# EAGLE design cc2651r3 (EAGLE 9.6.2)
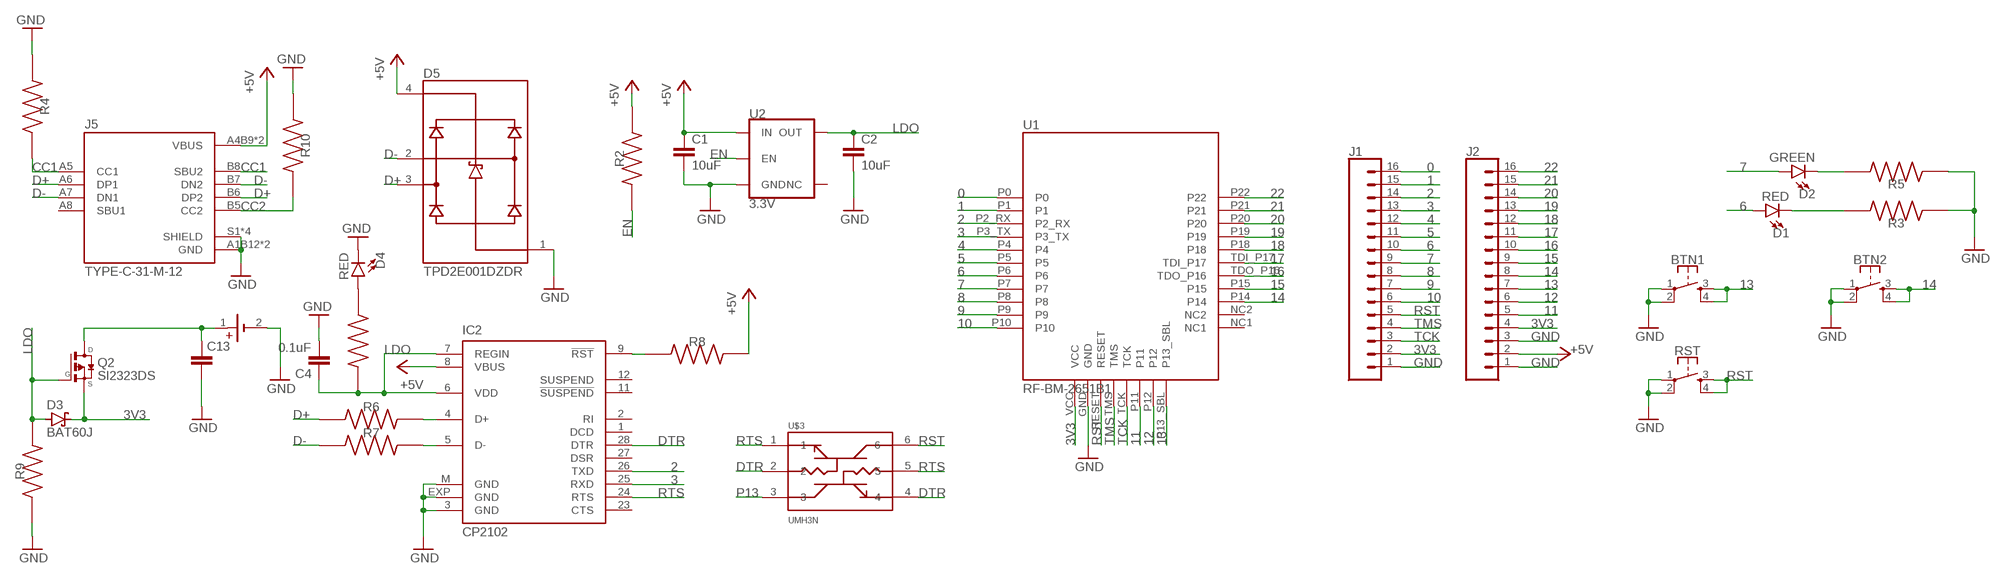
[diagram p0: schematic, sheet 1]

## Parts
BT2  79527141  [79527141]
BTN1  MOMENTARY-SWITCH-SPST-2-SMD-4.6X2.8MM  [TACTILE_SWITCH_SMD_4.6X2.8MM]
BTN2  MOMENTARY-SWITCH-SPST-2-SMD-4.6X2.8MM  [TACTILE_SWITCH_SMD_4.6X2.8MM]
C1  10uF  10UF-0603-6.3V-20%  [0603]
C2  10uF  10UF-0603-6.3V-20%  [0603]
C4  0.1uF  0.1UF-0603-25V-(+80/-20%)  [0603]
C13  C_TANTALUM-2917(7343-METRIC)  [CAPM7343X310]
D1  RED  LED-RED0603  [LED-0603]
D2  GREEN  LED-GREEN0603  [LED-0603]
D3  BAT60J  [SOD323_ST]
D4  RED  LED-RED0603  [LED-0603]
D5  TPD2E001DZDR  [SOT192P237X122-4N]
IC2  CP2102  [MLP28]
J1  CONN_161X16_NO_SILK  [1X16_NO_SILK]
J2  CONN_161X16_NO_SILK  [1X16_NO_SILK]
J5  TYPE-C-31-M-12  [HRO_TYPE-C-31-M-12]
Q2  SI2323DS  [SOT23]
R2  RC0402FR-073M6L  [RESC1005X40N]
R3  RC0402FR-073M6L  [RESC1005X40N]
R4  RC0402FR-073M6L  [RESC1005X40N]
R5  RC0402FR-073M6L  [RESC1005X40N]
R6  RC0402FR-073M6L  [RESC1005X40N]
R7  RC0402FR-073M6L  [RESC1005X40N]
R8  RC0402FR-073M6L  [RESC1005X40N]
R9  RC0402FR-073M6L  [RESC1005X40N]
R10  RC0402FR-073M6L  [RESC1005X40N]
R11  RC0402FR-073M6L  [RESC1005X40N]
RST  MOMENTARY-SWITCH-SPST-2-SMD-4.6X2.8MM  [TACTILE_SWITCH_SMD_4.6X2.8MM]
U1  RF-BM-2651B1  [RF-BM-2651B1]
U2  3.3V  V_REG_AP2112K-3.3V  [SOT23-5]
U$3  UMH3N  [SOP65P210X100-6N]

## Nets
0: J1.16 U1.P0
1: J1.15 U1.P1
2: IC2.26(TXD) J1.14 U1.P2_RX
3: IC2.25(RXD) J1.13 U1.P3_TX
3V3: D3.C J1.2 J2.4 Q2.2(S) U1.VCC
4: J1.12 U1.P4
5: J1.11 U1.P5
6: D1.A J1.10 U1.P6
7: D2.A J1.9 U1.P7
8: J1.8 U1.P8
9: J1.7 U1.P9
10: J1.6 U1.P10
11: J2.5 U1.P11
12: J2.6 U1.P12
13: BTN1.3 BTN1.4 J2.7 U1.P13_SBL
14: BTN2.3 BTN2.4 J2.8 U1.P14
15: J2.9 U1.P15
16: J2.10 U1.TDO_P16
17: J2.11 U1.TDI_P17
18: J2.12 U1.P18
19: J2.13 U1.P19
20: J2.14 U1.P20
21: J2.15 U1.P21
22: J2.16 U1.P22
+5V: C1.1 D5.4(VCC) IC2.8(VBUS) J2.2 J5.A4B9(VBUS) J5.B4A9(VBUS) R2.2 R8.2 U2.1(IN)
CC1: J5.A5(CC1) J5.B8(SBU2) R4.2
CC2: J5.B5(CC2) R10.2
D+: D5.3(IO2) J5.A6(DP1) J5.B6(DP2) R6.1
D-: D5.2(IO1) J5.A7(DN1) J5.B7(DN2) R7.1
DTR: IC2.28(DTR) U$3.2 U$3.4
EN: R2.1 U2.3(EN)
GND: BT2.2(-) BTN1.1 BTN1.2 BTN2.1 BTN2.2 C1.2 C2.2 C4.2 C13.2 D4.C D5.1(GND) IC2.3(GND) IC2.EXP(GND) IC2.M(GND) J1.1 J2.1 J2.3 J5.A1B12(GND) J5.B1A12(GND) J5.S1(SHIELD) J5.S2(SHIELD) J5.S3(SHIELD) J5.S4(SHIELD) R3.1 R4.1 R5.1 R9.1 R10.1 RST.1 RST.2 U1.GND U2.2(GND)
LDO: C2.1 C4.1 D3.A IC2.6(VDD) IC2.7(REGIN) Q2.1(G) R9.2 R11.2 U2.5(OUT)
N$1: IC2.9(!RST) R8.1
N$2: D1.C R3.2
N$3: D2.C R5.2
N$5: IC2.4(D+) R6.2
N$6: IC2.5(D-) R7.2
N$7: BT2.1(+) C13.1 Q2.3(D)
N$8: D4.A R11.1
P13: U$3.3
RST: J1.5 RST.3 RST.4 U1.RESET U$3.6
RTS: IC2.24(RTS) U$3.1 U$3.5
TCK: J1.3 U1.TCK
TMS: J1.4 U1.TMS
Unconnected: IC2.1(DCD) IC2.2(RI) IC2.11(!SUSPEND) IC2.12(SUSPEND) IC2.23(CTS) IC2.27(DSR) J5.A8(SBU1) U1.NC1 U1.NC2 U2.4(NC)

## Library data of the parts
BT2 = Battery Holder_2:79527141: BATTERY HOLDER COIN 20MM SMD Manufacturer's datasheet <https://katalog.we-online.de/em/datasheet/79527141.pdf>; CREATED_BY: PCBLayout.com; DIGIKEY_PART_NO: 732-12325-2-ND; MANUFACTURER: Wurth Electronics Inc.; MPN: 79527141
BTN1 BTN2 RST = SparkFun-Switches:MOMENTARY-SWITCH-SPST-2: Momentary Switch (Pushbutton) - SPST - Two Circuits Normally-open (NO) SPST momentary switches (buttons, pushbuttons). Schematic symbol includes two switch circuits. Variants SMD-4.6MMX2.8MM - 4.60mm x 2.80mm Tactile Momentary Button Switch - Used on SparkFun SAMD21 Mini Breakout <https://www.sparkfun.com/products/13664> SMD-5.2MM - Mini Pushbutton Switch - SMD <https://www.sparkfun.com/products/8720> - Used on Arduino Pro Mini <https://www.sparkfun.com/products/11114>; PROD_ID: SWCH-13065
C1 C2 = SparkFun-Capacitors:10UF: 10.0µF ceramic capacitors A capacitor is a passive two-terminal electrical component used to store electrical energy temporarily in an electric field.; PROD_ID: CAP-11015
C4 = SparkFun-Capacitors:0.1UF: 0.1µF ceramic capacitors A capacitor is a passive two-terminal electrical component used to store electrical energy temporarily in an electric field.; PROD_ID: CAP-00810
C13 = Capacitor:C: Capacitor - Generic; CATEGORY: Capacitor
D1 D4 = SparkFun-LED:LED-RED: Red SMD LED Used in manufacturing of most products at SparkFun Packages: 0603 - SMD 0603 package [Product Link] <http://docs.avagotech.com/docs/AV02-0551EN> 0603 SMART - SMD 0603 SMART package ( more efficient and expensive)[Product Link] <http://www.osram-os.com/Graphics/XPic2/00077099_0.pdf> 1206 - SMD1206 package [Product Link] <https://www.sparkfun.com/datasheets/DevTools/LilyPad/Q150OVS4.pdff> SparkFun Products: Pro Mini 328 -5V <https://www.sparkfun.com/products/821> RedBoard <https://www.sparkfun.com/products/12757> IOIO-OTG <https://www.sparkfun.com/products/13613>; PROD_ID: DIO-00819
D2 = SparkFun-LED:LED-GREEN: Green SMD LED Used in manufacturing of various products at SparkFun Packages: 0603 - SMD 0603 package [Product Link] <http://www.futureelectronics.com/en/technologies/semiconductors/optoelectronics/leds/Pages/9894312-LTST-C190GKT.aspx?CrossPart=HSMG-C190&IM=0> LilyPad 1206 - SMD1206 LilyPad package [Product Link] <http://www.futureelectronics.com/en/Technologies/Product.aspx?ProductID=IN150NGHARVATEKCORPORATION2049943&IM=0> 1206 - SMD1206 package [Product Link] <http://www.futureelectronics.com/en/technologies/semiconductors/optoelectronics/leds/Pages/8315665-LTST-C150KGKT.aspx?IM=0> 1206 Bottom Mount -SMD 1206 Bottom Mount [Product Link] <http://www.digikey.com/product-detail/en/lite-on-inc/LTST-C230KGKT/160-1456-1-ND/386854> SparkFun Products: Pro Mini 328 -5V <https://www.sparkfun.com/products/821> RedBoard <https://www.sparkfun.com/products/12757> MP3 Trigger <https://www.sparkfun.com/products/13720> Makey Makey <https://www.sparkfun.com/products/11076>; PROD_ID: DIO-00821
D3 = diode:BAT60J: Schottky barrier diode Source: www.st.com, BAT60J.pdf
D5 = TPD2E001DZDR:TPD2E001DZDR: Low-capacitance 2-channel +/-15k-V ESD protection array for high-speed data interfaces Check prices <https://pricing.snapeda.com/parts/TPD2E001DZDR/Texas%20Instruments/view-part?ref=eda>; AVAILABILITY: In Stock; DESCRIPTION: Low-capacitance 2-channel +/-15k-V ESD protection array for high-speed data interfaces 4-SOT-23 -40 to 85; MF: Texas Instruments; MP: TPD2E001DZDR; PACKAGE: SOT-23-4 Texas Instruments; PRICE: None; PURCHASE-URL: https://pricing.snapeda.com/search/part/TPD2E001DZDR/?ref=eda
IC2 = silabs:CP210*: Single-Chip USB to UART Bridge Source: www.silabs.com .. CP2101.pdf / cp2102.pdf; MF: FARNELL; MPN: CP2102-GM; OC_FARNELL: 9282130; OC_NEWARK: 30K5635
J1 J2 = SparkFun-Connectors:CONN_16: Multi connection point. Often used as Generic Header-pin footprint for 0.1 inch spaced/style header connections On any of the 0.1 inch spaced packages, you can populate with these: Break Away Headers - Straight <https://www.sparkfun.com/products/116> (PRT-00116) Break Away Male Headers - Right Angle <https://www.sparkfun.com/products/553> (PRT-00553) Female Headers <https://www.sparkfun.com/products/115> (PRT-00115) Break Away Headers - Machine Pin <https://www.sparkfun.com/products/117> (PRT-00117) Break Away Female Headers - Swiss Machine Pin <https://www.sparkfun.com/products/743> (PRT-00743) For SCREWTERMINALS and SPRING TERMINALS visit here: Screw Terimnals on SparkFun.com <https://www.sparkfun.com/search/results?term=Screw+Terminals> (5mm/3.5mm/2.54mm spacing) This device is also useful as a general connection point to wire up your design to another part of your project. Our various solder wires solder well into these plated through hole pads. Hook-Up Wire - Assortment (Stranded, 22 AWG) <https://www.sparkfun.com/products/11375> (PRT-11375) Hook-Up Wire - Assortment (Solid Core, 22 AWG) <https://www.sparkfun.com/products/11367> (PRT-11367) View the entire wire category on our website here <https://www.sparkfun.com/categories/141> Special notes: Molex polarized connector foot print use with SKU : PRT-08231 with associated crimp pins and housings. 1MM SMD Version SKU: PRT-10208 NOTES ON THE VARIANTS LOCK and LOCK_LONGPADS... This footprint was designed to help hold the alignment of a through-hole component (i.e. 6-pin header) while soldering it into place. You may notice that each hole has been shifted either up or down by 0.005 of an inch from it's more standard position (which is a perfectly straight line). This slight alteration caused the pins (the squares in the middle) to touch the edges of the holes. Because they are alternating, it causes a "brace" to hold the component in place. 0.005 has proven to be the perfect amount of "off-center" position when using our standard breakaway headers. Although looks a little odd when you look at the bare footprint, once you have a header in there, the alteration is very hard to notice. Also,if you push a header all the way into place, it is covered up entirely on the bottom side.
J5 = TYPE-C-31-M-12:TYPE-C-31-M-12: USB Connectors 24 Receptacle 1 8.94*7.3mm RoHS; AVAILABILITY: Unavailable; DESCRIPTION: USB Connectors 24 Receptacle 1 8.94*7.3mm RoHS; MF: HRO Electronics Co., Ltd.; MP: TYPE-C-31-M-12; PACKAGE: Package; PRICE: None
Q2 = SI2323DS:SI2323DS: P-Channel MOSFET; AVAILABILITY: Unavailable; DESCRIPTION: P-Channel 20V 3.7A (Ta) 750mW (Ta) Surface Mount SOT-23-3 (TO-236); MF: Vishay Siliconix; MP: SI2323DS; PACKAGE: SOT-23-3 Vishay Siliconix; PRICE: None
R2-R11 = RC0402FR-073M6L:RC0402FR-073M6L: RESISTOR, 0402 0.063W 1% 3M6; Resistance:3.6Mohm; Resistance Tolerance:± 1%; Power Rating:0.063W; Voltage Rating:50V; Series:RC32H; Temperature Coefficient:± 100ppm/°C; Resistor Element Type:Thick Film; Resistor Case Style:0402; No. of Pins:2; SVHC:No SVHC; Case Style:0402; External Length / Height:1mm; Temperature Coeff. +:100ppm/°C; Temperature Coeff. -:100ppm/°C; External Depth:0.35mm; External Width:0.5mm; Operating Temperature Range:-55°C to +155°C; Overload Voltage:100V Check prices <https://pricing.snapeda.com/parts/RC0402FR-073M6L/Yageo/view-part?ref=eda>; AVAILABILITY: Good; DESCRIPTION: RESISTOR, 0402 0.063W 1% 3M6; Resistance:3.6Mohm; Resistance Tolerance:± 1%; Power Rating:0.063W; Voltage Rating:50V; Series:RC32H; Temperature Coefficient:± 100ppm/°C; Resistor Element Type:Thick Film; Resistor Case Style:0402; No. of Pins:2; SVHC:No SVHC; Case Style:0402; External Length / Height:1mm; Temperature Coeff. +:100ppm/°C; Temperature Coeff. -:100ppm/°C; External Depth:0.35mm; External Width:0.5mm; Operating Temperature Range:-55°C to +155°C; Overload Voltage:100V; MF: Yageo; MP: RC0402FR-073M6L; PACKAGE: 1005 Panasonic Electronic Components; PRICE: None; PURCHASE-URL: https://pricing.snapeda.com/search/part/RC0402FR-073M6L/?ref=eda
U1 = rb-bm-2651b1:RF-BM-2651B1
U2 = SparkFun-IC-Power:V_REG_AP2112: AP2112 - 600mA CMOS LDO Regulator w/ Enable The AP2112 is CMOS process low dropout linear regulator with enable function, the regulator delivers a guaranteed 600mA (min.) continuous load current. Features Output Voltage Accuracy: ±1.5% Output Current: 600mA (Min.) Foldback Short Current Protection: 50mA Enable Function to Turn ON/OFF VOUT Low Dropout Voltage (3.3V): 250mV (Typ.) @IOUT=600mA Excellent Load Regulation: 0.2%/A (Typ.) Excellent Line Regulation: 0.02%/V (Typ.) Low Quiescent Current: 55μA (Typ.) Low Standby Current: 0.01μA (Typ.) Low Output Noise: 50μVRMS PSRR: 100Hz -65dB, 1kHz -65dB OTSD Protection Stable with 1.0μF Flexible Cap: Ceramic, Tantalum and Aluminum Electrolytic Operation Temperature Range: -40°C to 85°C ESD: MM 400V, HBM 4000V; PROD_ID: VREG-12457
U$3 = UMH3N:UMH3N: Dual PNP/NPN transistor for chip reset; AVAILABILITY: Unavailable; DESCRIPTION: Pre-Biased Bipolar Transistor (BJT) 2 NPN - Pre-Biased (Dual) 50V 100mA 250MHz 150mW Surface Mount UMT6; MF: Rohm; MP: UMH3N; PACKAGE: SOT-363 Rohm; PRICE: None

## Board
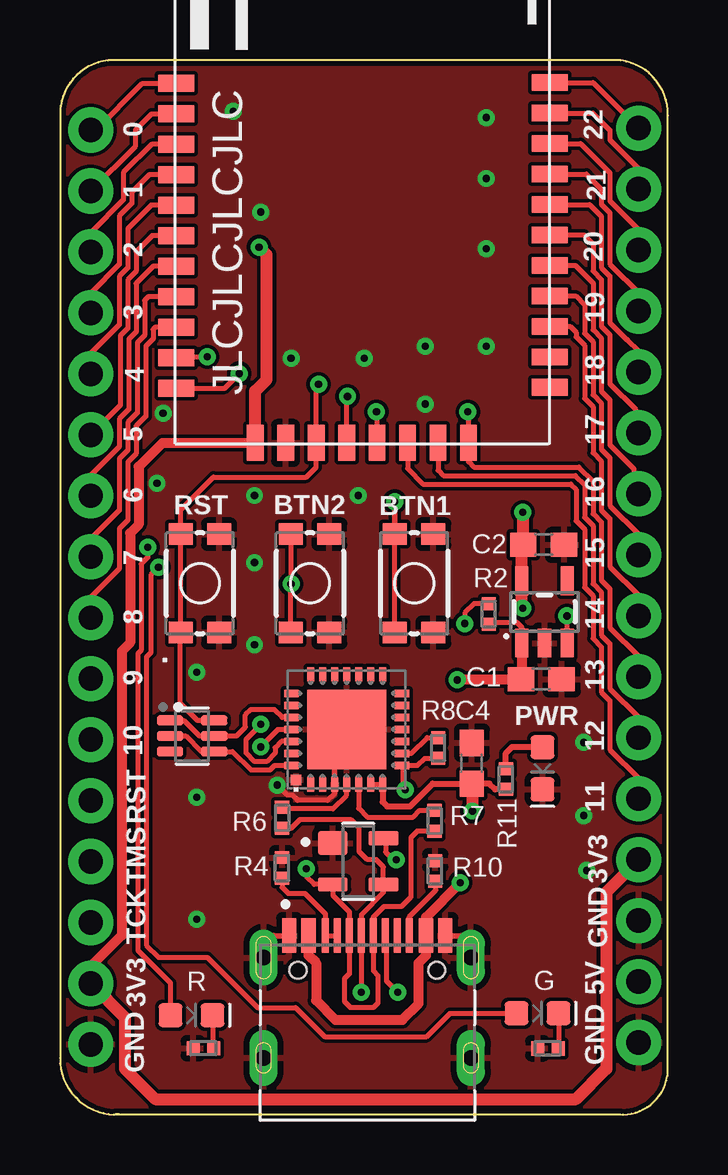
[diagram p1: board, top side]
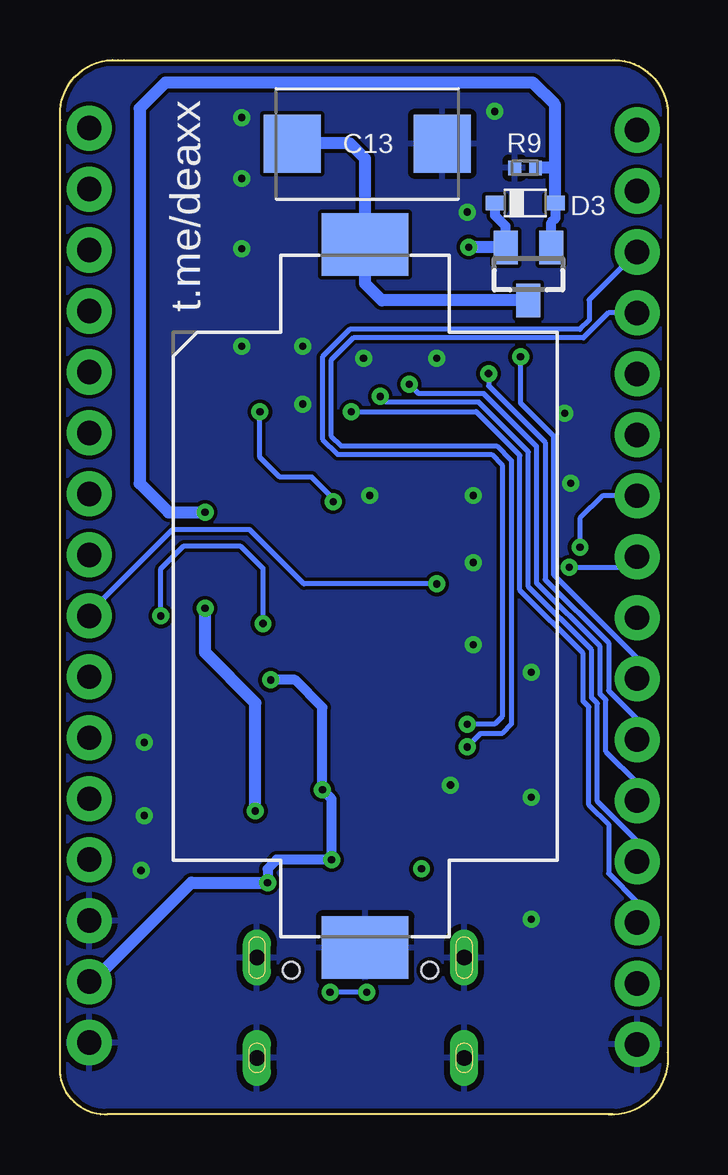
[diagram p2: board, bottom side, seen from below]

Size 25.33 x 43.94 mm. Coordinates in mm from the lower left corner, seen from the top.
Outline: 0.01,41.93 0.01,2.58 arc100 2.48,0 2.3,0.01 23.36,0.01 23.46,0 arc80 25.3,1.6 25.31,1.67 25.31,41.43 25.33,41.63 arc95 22.92,43.93 22.66,43.93 2.29,43.93 2.22,43.94 arc80 0.03,42.03 0.01,41.93
Copper layers (1+2*15+16): Top 0.035mm / dielectric 0.2mm / Route2 0.035mm / dielectric 0.15mm / Route15 0.035mm / dielectric 0.2mm / Bottom 0.035mm
Design rules "default *": minimum track width 0.15mm, minimum drill 0.3mm, track to track 6mil, track to pad 6mil, pad to pad 6mil, via to via 6mil, smd to smd 6mil, copper to edge 0.2mm, drill to drill 0.3mm, minimum pad ring 10mil, minimum via ring 8mil, stop-mask expansion 4mil, vias tented up to drill 0.3mm, thermal gap 10mil

### Footprints (pad centres in the part's own frame; a part is rotated, then mirrored left to right if it is on the bottom)
79527141 = smd 2.6 x 3.6: 1 -14.65,0; 2 14.65,0
TACTILE_SWITCH_SMD_4.6X2.8MM = smd 0.9 x 1: 1 -2.05,-0.8; 2 2.05,-0.8; 3 2.05,0.8; 4 -2.05,0.8
0603 = smd 1.1 x 1: 1 -0.85,0; 2 0.85,0
CAPM7343X310 = smd 2.368 x 2.404: 1 -3.121,0; 2 3.121,0
LED-0603 = smd 1 x 1: A -0.877,0; C 0.877,0
SOD323_ST = smd 0.8 x 0.6: A 1.25,0; C -1.25,0
SOT192P237X122-4N = smd 1.24 x 0.99: 1 -1.055,0.76 | smd 1.24 x 0.59: 2 -1.055,-0.96; 3 1.055,-0.96; 4 1.055,0.96
MLP28 = smd 0.6 x 0.3: 1 -2.3,1.5; 2 -2.3,1; 3 -2.3,0.5; 4 -2.3,0; 5 -2.3,-0.5; 6 -2.3,-1; 7 -2.3,-1.5; 15 2.3,-1.5; 16 2.3,-1; 17 2.3,-0.5; 18 2.3,0; 19 2.3,0.5; 20 2.3,1; 21 2.3,1.5 | smd 0.3 x 0.6: 8 -1.5,-2.3; 9 -1,-2.3; 10 -0.5,-2.3; 11 0,-2.3; 12 0.5,-2.3; 13 1,-2.3; 14 1.5,-2.3; 22 1.5,2.3; 23 1,2.3; 24 0.5,2.3; 25 0,2.3; 26 -0.5,2.3; 27 -1,2.3; 28 -1.5,2.3 | smd 3.3 x 3.3: EXP 0,0 | smd 0.435 x 0.435: M -2.103,2.103
1X16_NO_SILK = drill 1.016 pad 1.88: 1 0,0; 2 2.54,0; 3 5.08,0; 4 7.62,0; 5 10.16,0; 6 12.7,0; 7 15.24,0; 8 17.78,0; 9 20.32,0; 10 22.86,0; 11 25.4,0; 12 27.94,0; 13 30.48,0; 14 33.02,0; 15 35.56,0; 16 38.1,0
HRO_TYPE-C-31-M-12 = smd 0.6 x 1.45: A1B12 -3.25,5.095; A4B9 -2.45,5.095; B1A12 3.25,5.095; B4A9 2.45,5.095 | smd 0.3 x 1.45: A5 -1.25,5.095; A6 -0.25,5.095; A7 0.25,5.095; A8 1.25,5.095; B5 1.75,5.095; B6 0.75,5.095; B7 -0.75,5.095; B8 -1.75,5.095 | drill 0.65 pad 1.05 long: S1 -4.32,4.18; S2 4.32,4.18; S3 -4.32,0; S4 4.32,0 | hole 0.7: -2.89,3.65; 2.89,3.65
SOT23 = smd 1 x 1.4: 1 -0.95,-1.1; 2 0.95,-1.1; 3 0,1.1
RESC1005X40N = smd 0.54 x 0.6: 1 -0.432,0; 2 0.432,0
RF-BM-2651B1 = smd 0.7 x 1.5: GND 4.599,0.037; P11 9.679,0.037; P12 10.949,0.037; P13_SBL 12.219,0.037; RESET 5.869,0.037; TCK 8.409,0.037; TMS 7.139,0.037; VCC 3.329,0.037 | smd 1.5 x 0.7: NC1 15.61,2.346; NC2 15.61,3.616; P0 0.039,15.017; P1 0.039,13.746; P2_RX 0.039,12.476; P3_TX 0.039,11.207; P4 0.039,9.937; P5 0.039,8.666; P6 0.039,7.396; P7 0.039,6.127; P8 0.039,4.856; P9 0.039,3.587; P10 0.039,2.317; P14 15.61,4.886; P15 15.61,6.157; P18 15.61,9.966; P19 15.61,11.236; P20 15.61,12.507; P21 15.61,13.777; P22 15.61,15.046; TDI_P17 15.61,8.697; TDO_P16 15.61,7.426
SOT23-5 = smd 0.55 x 1.2: 1 -0.95,-1.3; 2 0,-1.3; 3 0.95,-1.3; 4 0.95,1.3; 5 -0.95,1.3
SOP65P210X100-6N = smd 1.09 x 0.4: 1 -0.92,0.65; 2 -0.92,0; 3 -0.92,-0.65; 4 0.92,-0.65; 5 0.92,0; 6 0.92,0.65

### Placement (x,y rotation side)
BT2  12.61,21.6 270 bottom
BTN1  14.76,22.14 90 top
BTN2  10.42,22.14 90 top
C1  20.05,18.14 0 top
C2  20.15,23.74 0 top
C4  17.16,14.63 90 top
C13  12.52,40.45 0 bottom
D1  5.48,4.14 0 top
D2  19.9,4.22 0 top
D3  5.95,37.99 0 bottom
D4  20.11,14.43 270 top
D5  12.42,10.55 0 top
IC2  11.94,16.05 90 top
J1  1.28,2.92 90 top
J2  24.11,3 90 top
J5  12.8,2.36 0 top
Q2  5.81,35.03 180 bottom
R2  17.86,20.86 270 top
R3  5.98,2.76 0 top
R4  9.25,10.28 270 top
R5  20.33,2.76 0 top
R6  9.26,12.37 90 top
R7  15.6,12.24 90 top
R8  15.76,15.28 270 top
R9  5.95,39.45 0 bottom
R10  15.63,10.15 270 top
R11  18.58,13.98 270 top
RST  5.83,22.14 90 top
U1  4.8,27.95 0 top
U2  20.19,20.95 0 top
U$3  5.5,15.77 0 top

### Tracks (layer width: path | path; a pad name or v marks a point on that pad's centre or on a via)
0
  Top 0.2: J1.16 1.49,41.02 3.44,42.97 U1.P0
1
  Top 0.2: J1.15 3.15,40.35 3.15,41.03 3.82,41.7 U1.P1
2  (via drill 0.3)
  Top 0.2: U1.P2_RX 3.82,40.43 2.64,39.26 2.64,38.11 1.28,36.75 J1.14 | IC2.26 9.23,15.55 8.97,15.29 8.97,15.06 8.61,14.71 8.11,14.71 7.75,15.06 7.75,15.63 8.36,16.24 v8.36,16.27
  Bottom 0.2: J1.14 3.28,33.94 3.28,33.1 3.66,32.71 13.25,32.71 14.39,31.57 14.39,28.14 13.76,27.51 7.35,27.51 6.9,27.06 6.9,16.58 7.22,16.27 v8.36,16.27
3  (via drill 0.3)
  Top 0.2: U1.P3_TX 3.73,39.16 3,38.43 3,37.97 2.47,37.44 2.47,35.42 1.28,34.23 J1.13 | v8.36,15.32 9.09,16.05 IC2.25
  Bottom 0.2: J1.13 2.48,33.4 3.51,32.36 13.1,32.36 14.04,31.43 14.04,28.29 13.61,27.86 7.14,27.86 6.52,27.25 6.52,16.27 6.91,15.89 7.79,15.89 v8.36,15.32
3V3  (via drill 0.3)
  Top 0.406: U1.VCC 4.27,27.99 3.28,26.99 3.28,24.58 2.93,24.22 2.93,19.66 2.57,19.31 2.57,7.46 1.28,6.17 J1.2
  Top 0.508: U1.VCC 8.13,30.14 8.61,30.62 8.61,35.83 v8.3,36.14 | J2.4 22.76,9.27 22.76,1.9 21.5,0.65 3.98,0.65 2.71,1.92 2.71,4.03 J1.2
  Bottom 0.406: Q2.2 6.76,37.02 7.2,37.46 D3.C
  Bottom 0.508: Q2.2 6.78,36.14 v8.3,36.14
4
  Top 0.2: U1.P4 3.8,37.89 2.82,36.91 2.82,35.27 2.47,34.92 2.47,32.91 1.28,31.72 J1.12
5
  Top 0.2: U1.P5 3.84,36.62 3.18,35.95 3.18,35.13 2.82,34.77 2.82,32.76 2.52,32.45 2.52,29.56 J1.11
6  (via drill 0.3)
  Top 0.2: U1.P6 3.9,35.35 3.18,34.63 3.18,32.62 2.87,32.31 2.87,29.38 2.47,28.99 2.47,27.83 1.28,26.64 J1.10 | v3.66,23.63 3.66,23.22 3.38,22.94 3.38,19.34 3.25,19.2 3.25,6.84 4.6,5.48 D1.A
  Bottom 0.2: J1.10 2.72,25.78 3.66,24.84 v3.66,23.63
7  (via drill 0.3)
  Top 0.2: U1.P7 3.69,34.08 3.53,33.92 3.53,32.47 3.22,32.16 3.22,29.24 2.82,28.84 2.82,27.68 2.47,27.33 2.47,25.18 1.28,23.98 J1.9 | v4.11,22.81 3.79,22.49 3.79,19.24 3.6,19.06 3.6,7.06 4.11,6.55 6.14,6.55 8.23,4.46 9.82,4.46 11.03,3.25 15.28,3.25 16.23,4.2 19,4.2 D2.A
  Bottom 0.2: J1.9 1.72,22.8 4.09,22.8 v4.11,22.81
8
  Top 0.2: U1.P8 3.98,32.81 3.88,32.71 3.88,32.32 3.57,32.02 3.57,29.09 3.18,28.69 3.18,27.54 2.82,27.18 2.82,24.77 2.47,24.41 2.47,22.75 1.28,21.56 J1.8
9  (via drill 0.3)
  Top 0.2: U1.P9 4.88,31.57 v6.14,31.57
  Bottom 0.2: J1.7 1.28,19.02 4.76,22.49 4.76,28.26 6.14,29.64 v6.14,31.57
10  (via drill 0.3)
  Top 0.2: U1.P10 6.87,30.27 v7.47,30.87
  Bottom 0.2: v7.47,30.87 7.47,30.36 5.11,28 5.11,22.29 2.47,19.65 2.47,17.67 1.28,16.48 J1.6
11
  Top 0.2: U1.P11 14.48,26.91 15.13,26.27 21.29,26.27 21.51,26.05 21.51,24.74 21.86,24.39 21.86,21.97 22.21,21.61 22.21,19.83 22.56,19.47 22.56,17.6 22.92,17.25 22.92,15.21 24.11,14.01 J2.5
12
  Top 0.2: U1.P12 15.75,26.85 15.98,26.62 21.48,26.62 21.86,26.24 21.86,24.89 22.21,24.53 22.21,22.11 22.56,21.76 22.56,19.97 22.92,19.62 22.92,17.75 24.11,16.55 J2.6
13  (via drill 0.3)
  Top 0.2: J2.7 24.11,19.09 22.92,20.29 22.92,21.91 22.56,22.26 22.56,24.68 22.21,25.03 22.21,26.38 21.62,26.97 17.25,26.97 17.02,27.2 U1.P13_SBL 17.02,29.26 v17,29.29 | BTN1.4 v13.96,25.54 v13.95,25.54 13.95,24.2 BTN1.3
  Bottom 0.2: v13.95,25.54 13.95,25.67 14.84,26.56 16.17,26.56 17,27.38 v17,29.29
14  (via drill 0.3)
  Top 0.2: U1.P14 21.25,32.84 21.51,32.59 21.51,32.4 21.86,32.05 21.86,29.84 22.21,29.49 22.21,27.57 22.56,27.22 22.56,25.18 22.92,24.83 22.92,22.83 24.11,21.63 J2.8 | BTN2.4 v9.62,22.1 | v9.62,22.1 v9.63,22.11 | BTN2.3 v9.62,22.1
  Bottom 0.2: v9.63,22.11 15.16,22.11 17.42,24.37 20.64,24.37 24.11,20.9 J2.8
15
  Top 0.2: U1.P15 21.48,34.11 21.86,33.73 21.86,32.55 22.21,32.2 22.21,29.99 22.56,29.63 22.56,27.72 22.92,27.37 22.92,25.37 24.11,24.17 J2.9
16
  Top 0.2: U1.TDO_P16 21.47,35.38 22.21,34.64 22.21,32.69 22.56,32.34 22.56,30.13 22.92,29.78 22.92,27.91 23.92,26.9 23.92,26.05 J2.10
17
  Top 0.2: U1.TDI_P17 21.83,36.65 22.21,36.27 22.21,35.14 22.56,34.79 22.56,32.84 22.92,32.49 22.92,30.45 23.98,29.38 23.98,28.53 J2.11
18
  Top 0.2: U1.P18 22.07,37.92 22.56,37.42 22.56,35.28 22.92,34.93 22.92,32.99 23.61,32.29 23.64,32.29 24.11,31.83 J2.12
19
  Top 0.2: U1.P19 21.93,39.19 22.56,38.56 22.56,37.92 22.92,37.57 22.92,35.43 24.17,34.18 24.17,33.54 J2.13
20
  Top 0.2: U1.P20 21.7,40.46 22.92,39.24 22.92,38.07 24.11,36.87 J2.14
21
  Top 0.2: U1.P21 22.21,41.73 22.92,41.02 22.92,40.61 24.11,39.41 J2.15
22
  Top 0.2: U1.P22 22.21,43 J2.16
+5V  (via drill 0.3)
  Top 0.2: D5.4 13.57,11.42 13.57,10.93 13.88,10.62 v14.01,10.62 | R2.2 17.96,20.52 19.03,20.52 19.24,20.31 U2.1 | R8.2 15.19,14.84 14.89,14.55 14.33,14.55 IC2.8
  Top 0.254: v14.39,13.54 14.33,13.6 14.33,14.55
  Top 0.406: U2.1 19.24,18.17 C1.1 19.18,18.11 v16.55,18.11 | J5.A4B9 10.35,6.64 10.67,6.32 10.67,4.75 11.47,3.95 14.27,3.95 14.94,4.63 14.94,6.32 15.25,6.64 J5.B4A9 15.25,8.23 16.68,9.65 v16.68,9.66
  Bottom 0.406: v16.68,9.66 16.68,10.24 16.3,10.62 v14.01,10.62 14.01,13.16 v14.39,13.54 14.39,16.97 15.53,18.11 v16.55,18.11
  Bottom 0.508: J2.2 23.98,5.54 19.85,9.66 v16.68,9.66
CC1
  Top 0.2: J5.A5 J5.B8 11.05,8.37 10.2,9.22 9.5,9.22 9.25,9.47 R4.2
CC2
  Top 0.2: J5.B5 14.55,8.24 15.66,9.35 15.66,9.69 R10.2
D+  (via drill 0.3)
  Top 0.2: R6.1 9.64,11.93 10.01,12.3 12.11,12.3 12.46,11.95 12.46,10.96 12.8,10.62 13.19,10.62 13.48,10.32 D5.3 13.48,9.26 12.55,8.33 J5.A6 v12.55,5.1 v12.55,5.09 | J5.B6 13.6,7.41 13.6,5.57 v14.07,5.09
  Bottom 0.2: v12.55,5.09 v14.07,5.09
D-  (via drill 0.3)
  Top 0.2: v10.26,10.24 10.26,9.92 10.59,9.59 D5.2 11.37,9.13 12.05,8.45 J5.B7 12.05,5.87 11.85,5.66 11.85,4.71 12.11,4.46 13.06,4.46 13.25,4.65 13.25,5.79 13.05,5.99 J5.A7 13.05,8.23 13.5,8.68 14.24,8.68 14.62,9.06 14.62,11.54 14.88,11.81 R7.1
DTR
  Top 0.2: U$3.2 5.23,15.77 5.88,15.12 U$3.4 7.2,15.12 7.96,14.36 8.76,14.36 8.95,14.55 IC2.28
EN  (via drill 0.3)
  Top 0.2: U2.3 21.14,20.76 v21.12,20.78 | R2.1 17.26,21.29 16.87,20.9 v16.87,20.46
  Bottom 0.2: v21.12,20.78 21.12,22.74 20.17,23.7 17.82,23.7 16.87,22.74 v16.87,20.46
GND  (via drill 0.3)
  Top 0.2: IC2.EXP 11.44,15.55 IC2.3 11.44,13.38 11.15,13.09 9.9,13.09 9.66,13.32 9.47,13.32 v9.06,13.73 | J5.B1A12 16.79,7.46 17.19,7.06 17.19,6.6 J5.S2 | J5.S1 8.48,7 8.95,7.46 J5.A1B12
  other vias: 17.76,41.54 17.76,39 17.76,36.08 17.76,32.02 15.22,32.02 15.22,29.6 9.63,31.51 12.68,31.51 8.11,25.79 12.42,25.79 8.11,23 8.11,19.57 5.69,18.43 5.69,13.22 5.69,8.14 21.82,15.51 21.82,12.46 21.95,10.17 8.36,37.6 7.22,41.8 4.04,26.3 4.3,29.22
  pour Top: -0.19,44.06 -0.19,-0.33 25.71,-0.33 25.71,44.06
  pour Bottom: -0.39,44.13 -0.39,-0.24 25.51,-0.24 25.51,44.13
LDO  (via drill 0.3)
  Top 0.254: IC2.6 IC2.7 13.44,13.02 13.63,12.84 14.59,12.84 15.02,13.28 15.53,13.78 C4.1 17.89,13.78 18.13,13.55 R11.2
  Top 0.508: v19.28,25.09 19.3,25.07 C2.1 19.24,23.68 U2.5 19.22,22.23 19.22,21.16 v19.28,21.09 | C4.1 17.19,13.76 v17.19,12.65
  Bottom 0.406: Q2.1 4.86,37.17 4.68,37.35 4.68,37.97 D3.A
  Bottom 0.508: Q2.1 4.86,35.88 | D3.A 4.7,39.38 | 4.7,39.38 4.7,42.07 5.63,43 20.93,43 22.01,41.92 22.01,26.3 20.81,25.09 v19.28,25.09 | 4.7,39.38 4.76,39.45 R9.2 | v17.19,12.65 17.19,17.16 19.28,19.25 v19.28,21.09
N$1
  Top 0.2: IC2.9 14.63,15.05 15.29,15.71 R8.1
N$2
  Top 0.2: D1.C 6.36,2.82 R3.2
N$3
  Top 0.2: D2.C 20.77,2.77 R5.2
N$5
  Top 0.2: IC2.4 11.94,13.31 11.37,12.73 9.32,12.73 R6.2
N$6
  Top 0.2: IC2.5 12.44,12.75 12.8,12.39 14.71,12.39 14.98,12.67 R7.2
N$7
  Bottom 0.508: BT2.1 12.61,39.83 13.25,40.46 15.63,40.46 C13.1 | 5.61,33.73 Q2.3 11.92,33.93 12.61,34.62 BT2.1 | BT2.1 12.55,36.19
N$8
  Top 0.254: R11.1 18.58,15.06 18.84,15.32 20.09,15.32 D4.A
RST  (via drill 0.3)
  Top 0.2: v10.77,30.43 10.67,30.33 U1.RESET 10.67,26.96 10.26,26.56 6.39,26.56 5.03,25.19 RST.3 RST.4 4.99,20.05 4.99,17.16 5.73,16.42 U$3.6
  Bottom 0.2: J1.5 1.28,13.82 2.58,15.12 2.58,17.28 2.82,17.52 2.82,19.51 5.46,22.14 5.46,27.83 7.69,30.05 10.39,30.05 v10.77,30.43
RTS
  Top 0.2: IC2.24 9.25,16.55 8.93,16.87 7.95,16.87 7.72,16.65 7.72,16.14 7.36,15.77 U$3.5 5.81,15.77 5.16,16.42 U$3.1
TCK  (via drill 0.3)
  Top 0.2: U1.TCK 13.21,29.26 v13.19,29.29
  Bottom 0.2: J1.3 1.28,8.86 2.47,10.05 2.47,12.09 3.29,12.9 3.29,16.99 3.53,17.23 3.53,19.21 6.17,21.85 6.17,27.47 7.98,29.29 v13.19,29.29
TMS  (via drill 0.3)
  Top 0.2: U1.TMS 11.94,29.88 v11.98,29.92
  Bottom 0.2: v11.98,29.92 11.75,29.7 7.89,29.7 5.81,27.62 5.81,22 3.18,19.36 3.18,17.38 2.93,17.13 2.93,13.05 1.28,11.4 J1.4

### Text on the board
tNames: 0 | 22 | 1 | 21 | 2 | 20 | 3 | 19 | 4 | 18 | JLCJLCJLCJLC | 5 | 17 | 6 | 16 | 7 | 15 | 8 | 14 | . | 9 | 13 | PWR | 12 | 10 | . | RST | 11 | TMS | 3V3 | TCK | GND | R | G | 3V3 | 5V | GND | GND
bNames: t.me/deaxx